# EAGLE design datalogger1.1 (EAGLE 9.6.2)
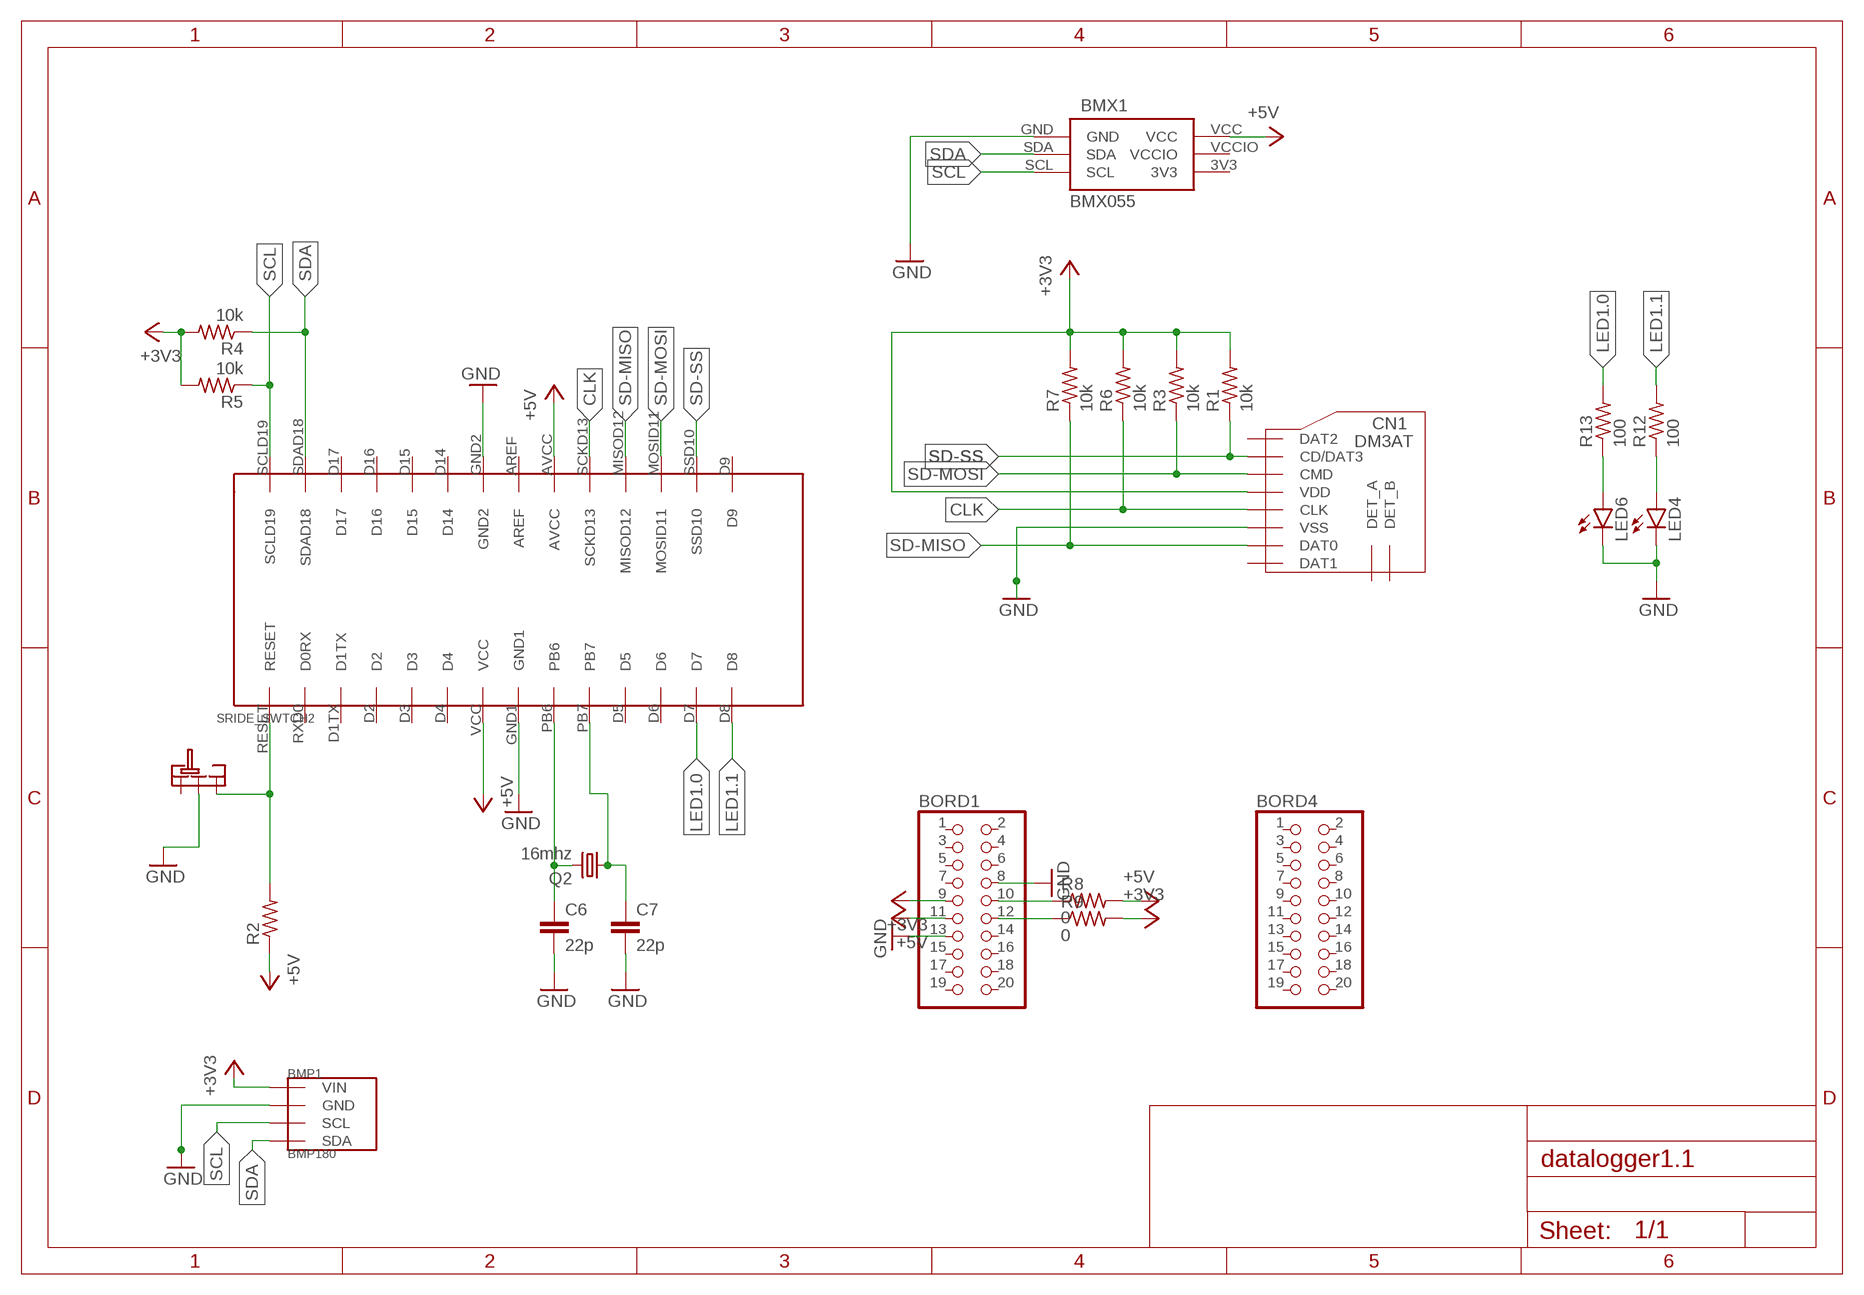
[diagram p0: schematic, sheet 1]

## Parts
BMP1  BMP180  [GY-68]
BMX1  BMX055  [BMX055]
BORD1  PINHD-2X10/90  [2X10/90]
BORD4  PINHD-2X10/90  [2X10/90]
C6  22p  C-EU025-024X044  [C025-024X044]
C7  22p  C-EU025-024X044  [C025-024X044]
CN1  DM3AT  [DM3AT]
LED4  LED5MM  [LED5MM]
LED6  LED5MM  [LED5MM]
Q2  16mhz  CRYSTALHC49S  [HC49/S]
R1  10k  R-US_0204/7  [0204/7]
R2  R-US_0204/7  [0204/7]
R3  10k  R-US_0204/7  [0204/7]
R4  10k  R-US_0204/7  [0204/7]
R5  10k  R-US_0204/7  [0204/7]
R6  10k  R-US_0204/7  [0204/7]
R7  10k  R-US_0204/7  [0204/7]
R8  0  R-US_0204/7  [0204/7]
R9  0  R-US_0204/7  [0204/7]
R12  100  R-US_0204/7  [0204/7]
R13  100  R-US_0204/7  [0204/7]
SRIDE_SWTCH2  SRIDE_SWITCH  [SRIDE_SWITCH]
U$6  ATMEGA238P  [ATMEGA328P]

## Nets
+3V3: BMP1.P1(VIN) BORD1.9 CN1.VDD R1.2 R3.2 R4.2 R5.2 R6.2 R7.2 R9.2
+5V [POWER_H]: BMX1.VCC BORD1.11 R2.1 R8.2 U$6.AVCC U$6.VCC
CLK: CN1.CLK R6.1 U$6.SCKD13
GND: BMP1.P2(GND) BMX1.GND BORD1.8 BORD1.13 C6.2 C7.2 CN1.VSS LED4.K(C) LED6.K(C) SRIDE_SWTCH2.LR U$6.GND1 U$6.GND2
LED1.0: R13.2 U$6.D7
LED1.1: R12.2 U$6.D8
N$1: LED6.A R13.1
N$2: C6.1 Q2.2 U$6.PB6
N$4: C7.1 Q2.1 U$6.PB7
N$6: BORD1.10 R8.1
N$7: LED4.A R12.1
N$8: R2.2 SRIDE_SWTCH2.R U$6.RESET
N$9: BORD1.12 R9.1
SCL: BMP1.P3(SCL) BMX1.SCL R5.1 U$6.SCLD19
SD-MISO: CN1.DAT0 R7.1 U$6.MISOD12
SD-MOSI: CN1.CMD R3.1 U$6.MOSID11
SD-SS: CN1.CD/DAT3 R1.1 U$6.SSD10
SDA: BMP1.P4(SDA) BMX1.SDA R4.1 U$6.SDAD18
Unconnected: BORD1.1 BORD1.2 BORD1.3 BORD1.4 BORD1.5 BORD1.6 BORD1.7 BORD1.14 BORD1.15 BORD1.16 BORD1.17 BORD1.18 BORD1.19 BORD1.20 BORD4.1 BORD4.2 BORD4.3 BORD4.4 BORD4.5 BORD4.6 BORD4.7 BORD4.8 BORD4.9 BORD4.10 BORD4.11 BORD4.12 BORD4.13 BORD4.14 BORD4.15 BORD4.16 BORD4.17 BORD4.18 BORD4.19 BORD4.20 CN1.DAT1 CN1.DAT2 CN1.DET_A CN1.DET_B SRIDE_SWTCH2.L U$6.AREF U$6.D1TX U$6.D2 U$6.D3 U$6.D4 U$6.D5 U$6.D6 U$6.D9 U$6.D14 U$6.D15 U$6.D16 U$6.D17 U$6.RXD0(D0RX)

## Power pins joined to a net without a drawn wire
3V3: BMX1.3V3
VCCIO: BMX1.VCCIO

## Library data of the parts
BMP1 = BMP180:BMP180
BMX1 = BMX055:BMX055
BORD1 BORD4 = pinhead:PINHD-2X10: PIN HEADER
C6 C7 = rcl:C-EU: CAPACITOR, European symbol; SPICEPREFIX: C
CN1 = microSD:DM3AT
LED4 LED6 = led:LED: LED OSRAM: - CHIPLED LG R971, LG N971, LY N971, LG Q971, LY Q971, LO R971, LY R971 LH N974, LH R974 LS Q976, LO Q976, LY Q976 LO Q996 - Hyper CHIPLED LW Q18S LB Q993, LB Q99A, LB R99A - SideLED LS A670, LO A670, LY A670, LG A670, LP A670 LB A673, LV A673, LT A673, LW A673 LH A674 LY A675 LS A676, LA A676, LO A676, LY A676, LW A676 LS A679, LY A679, LG A679 - Hyper Micro SIDELED® LS Y876, LA Y876, LO Y876, LY Y876 LT Y87S - SmartLED LW L88C, LW L88S LB L89C, LB L89S, LG L890 LS L89K, LO L89K, LY L89K LS L896, LA L896, LO L896, LY L896 - TOPLED LS T670, LO T670, LY T670, LG T670, LP T670 LSG T670, LSP T670, LSY T670, LOP T670, LYG T670 LG T671, LOG T671, LSG T671 LB T673, LV T673, LT T673, LW T673 LH T674 LS T676, LA T676, LO T676, LY T676, LB T676, LH T676, LSB T676, LW T676 LB T67C, LV T67C, LT T67C, LS T67K, LO T67K, LY T67K, LW E67C LS E67B, LA E67B, LO E67B, LY E67B, LB E67C, LV E67C, LT E67C LW T67C LS T679, LY T679, LG T679 LS T770, LO T770, LY T770, LG T770, LP T770 LB T773, LV T773, LT T773, LW T773 LH T774 LS E675, LA E675, LY E675, LS T675 LS T776, LA T776, LO T776, LY T776, LB T776 LHGB T686 LT T68C, LB T68C - Hyper Mini TOPLED® LB M676 - Mini TOPLED Santana® LG M470 LS M47K, LO M47K, LY M47K Source: http://www.osram.convergy.de LUXEON: - LUMILED® LXK2-PW12-R00, LXK2-PW12-S00, LXK2-PW14-U00, LXK2-PW14-V00 LXK2-PM12-R00, LXK2-PM12-S00, LXK2-PM14-U00 LXK2-PE12-Q00, LXK2-PE12-R00, LXK2-PE12-S00, LXK2-PE14-T00, LXK2-PE14-U00 LXK2-PB12-K00, LXK2-PB12-L00, LXK2-PB12-M00, LXK2-PB14-N00, LXK2-PB14-P00, LXK2-PB14-Q00 LXK2-PR12-L00, LXK2-PR12-M00, LXK2-PR14-Q00, LXK2-PR14-R00 LXK2-PD12-Q00, LXK2-PD12-R00, LXK2-PD12-S00 LXK2-PH12-R00, LXK2-PH12-S00 LXK2-PL12-P00, LXK2-PL12-Q00, LXK2-PL12-R00 Source: www.luxeon.com KINGBRIGHT: KA-3528ASYC Source: www.kingbright.com
Q2 = crystal:CRYSTAL: CRYSTAL; OC_FARNELL: 1667008; OC_NEWARK: unknown
R1-R9 R12 R13 = rcl:R-US_: RESISTOR, American symbol; SPICEPREFIX: R
SRIDE_SWTCH2 = Sride Switch:SRIDE_SWITCH
U$6 = atmega328p:ATMEGA238P

## Net classes
1 POWER_H: width 0.457 mm, drill 0.152 mm, clearance 0.152 mm

## Board
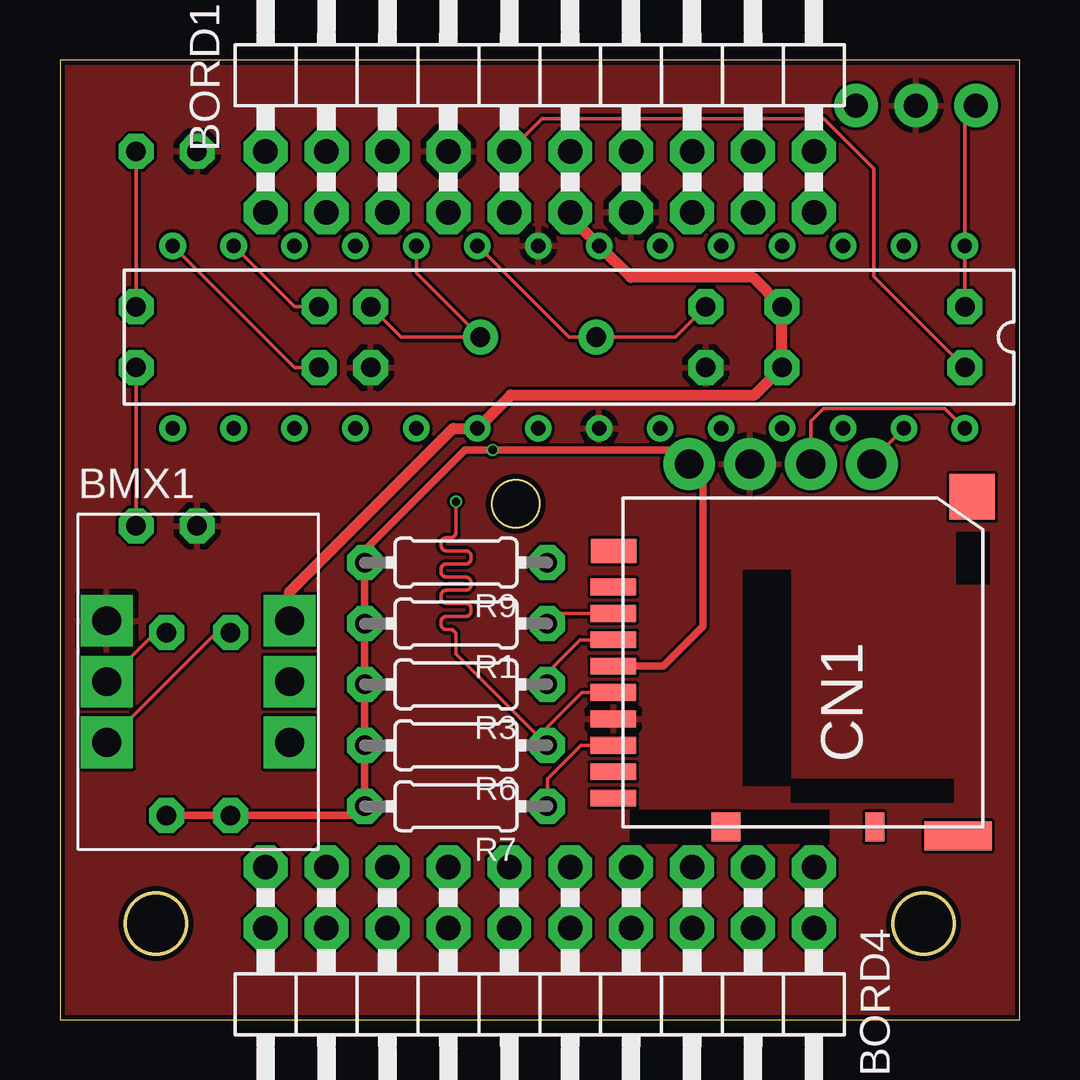
[diagram p1: board, top side]
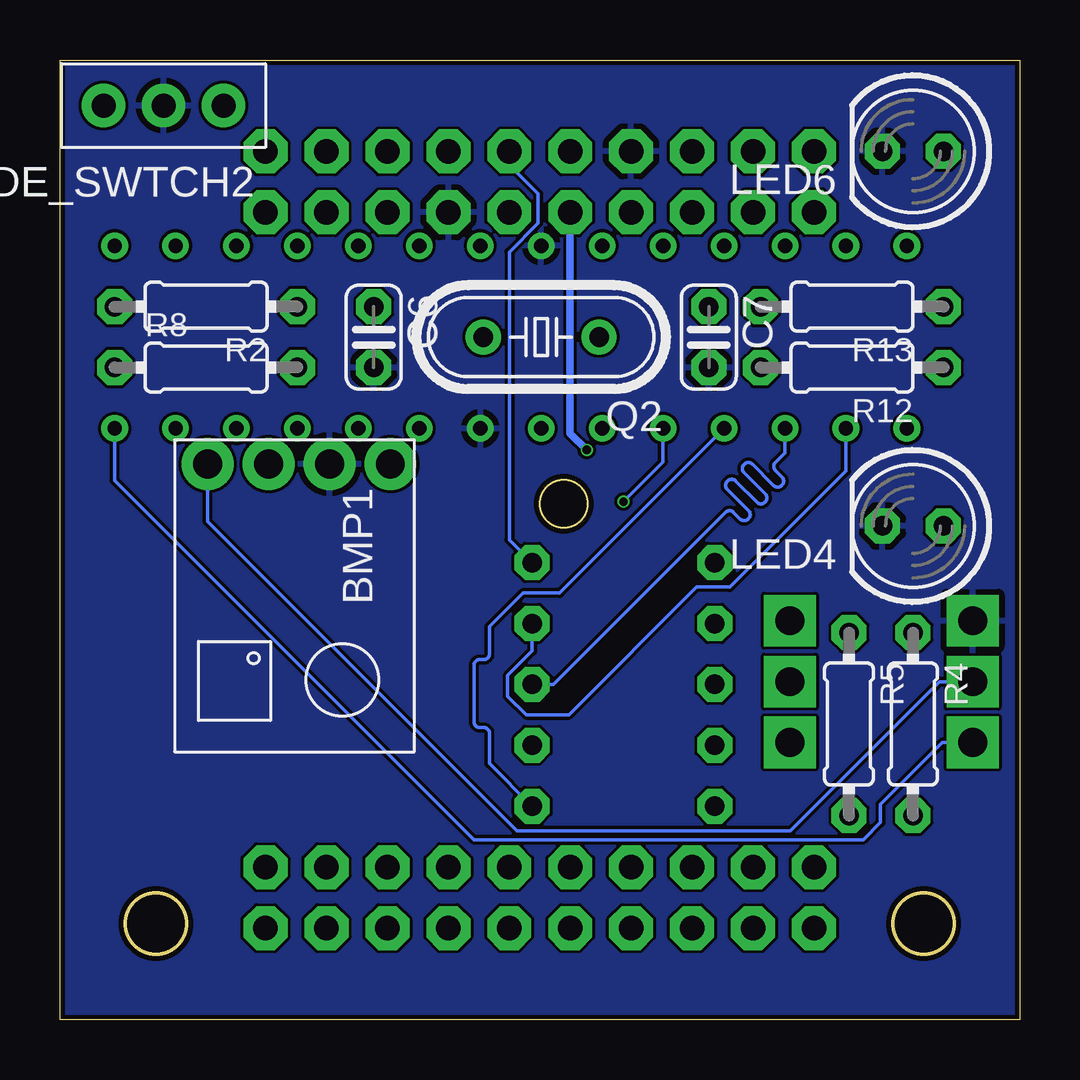
[diagram p2: board, bottom side, seen from below]

Size 40 x 40 mm. Coordinates in mm from the lower left corner, seen from the top.
Outline: 0,0 40,0 40,40 0,40 0,0
Outline: circle at 4,4 radius 1.27
Outline: circle at 36,4 radius 1.27
Outline: circle at 19,21.5 radius 1
Copper layers (1*16): Top 0.035mm / dielectric 1.6mm / Bottom 0.035mm
Design rules "jlcpcb-2layers": minimum track width 5mil, minimum drill 0.3mm, track to track 5mil, track to pad 5mil, pad to pad 5mil, via to via 5mil, smd to smd 5mil, copper to edge 0.2mm, drill to drill 6mil, minimum pad ring 10mil, minimum via ring 3mil, stop-mask expansion 4mil, vias tented up to drill 0mil, thermal gap 10mil

### Footprints (pad centres in the part's own frame; a part is rotated, then mirrored left to right if it is on the bottom)
GY-68 = drill 1.2: P1 -5,4; P2 -5,1.46; P3 -5,-1.08; P4 -5,-3.62
BMX055 = drill 1.2 pad 1.5 square: 3V3 8.81,-9.53; GND 1.19,-4.46; SCL 1.19,-9.53; SDA 1.19,-7; VCC 8.81,-4.46; VCCIO 8.81,-7
2X10/90 = drill 1.016 octagon: 1 -11.43,-6.35; 2 -11.43,-3.81; 3 -8.89,-6.35; 4 -8.89,-3.81; 5 -6.35,-6.35; 6 -6.35,-3.81; 7 -3.81,-6.35; 8 -3.81,-3.81; 9 -1.27,-6.35; 10 -1.27,-3.81; 11 1.27,-6.35; 12 1.27,-3.81; 13 3.81,-6.35; 14 3.81,-3.81; 15 6.35,-6.35; 16 6.35,-3.81; 17 8.89,-6.35; 18 8.89,-3.81; 19 11.43,-6.35; 20 11.43,-3.81
C025-024X044 = drill 0.813 octagon: 1 -1.27,0; 2 1.27,0
DM3AT = smd 0.7 x 1.9: CD/DAT3 2.2,6.4; CLK -1.1,6.4; CMD 1.1,6.4; DAT0 -3.3,6.4; DAT1 -4.4,6.4; DAT2 3.3,6.4; DET_B -5.5,6.4; VDD 0,6.4; VSS -2.2,6.4 | smd 1.2 x 0.8: DET_A -6.7,-4.5 | smd 1 x 1.9: P$9 4.8,6.381 | smd 1.2 x 1.2: P$11 -6.7,1.7 | smd 1.2 x 2.8: P$13 -7.081,-7.973 | smd 1.9 x 1.9: P$14 7.054,-8.562
LED5MM = drill 0.813 octagon: A -1.27,0; K 1.27,0
HC49/S = drill 0.813: 1 -2.413,0; 2 2.413,0
0204/7 = drill 0.813 octagon: 1 -3.81,0; 2 3.81,0
SRIDE_SWITCH = drill 1: L -2.5,0; LR 0,0; R 2.5,0
ATMEGA328P = drill 0.6: AREF 17.78,7.62; AVCC 20.32,7.62; D1TX 5.08,0; D2 7.62,0; D3 10.16,0; D4 12.7,0; D5 25.4,0; D6 27.94,0; D7 30.48,0; D8 33.02,0; D9 33.02,7.62; D14 12.7,7.62; D15 10.16,7.62; D16 7.62,7.62; D17 5.08,7.62; GND1 17.78,0; GND2 15.24,7.62; MISOD12 25.4,7.62; MOSID11 27.94,7.62; PB6 20.32,0; PB7 22.86,0; RESET 0,0; RXD0 2.54,0; SCKD13 22.86,7.62; SCLD19 0,7.62; SDAD18 2.54,7.62; SSD10 30.48,7.62; VCC 15.24,0

### Placement (x,y rotation side)
BMP1  30.23,18.16 270 bottom
BMX1  0.76,21.08 0 top
BORD1  20,40 0 top
BORD4  20,0 180 top
C6  26.92,28.45 270 bottom
C7  12.95,28.45 270 bottom
CN1  29.46,14.73 90 top
LED4  4.45,20.57 180 bottom
LED6  4.45,36.2 180 bottom
Q2  19.94,28.45 180 bottom
R1  16.51,16.51 180 top
R2  33.91,29.72 180 bottom
R3  16.51,13.97 180 top
R4  4.45,12.32 270 bottom
R5  7.11,12.32 270 bottom
R6  16.51,11.43 180 top
R7  16.51,8.89 180 top
R8  33.91,27.18 0 bottom
R9  16.51,19.05 180 top
R12  6.99,27.18 180 bottom
R13  6.99,29.72 180 bottom
SRIDE_SWTCH2  35.69,38.1 180 bottom
U$6  37.72,32.26 180 top

### Tracks (layer width: path | path; a pad name or v marks a point on that pad's centre or on a via)
+3V3  (via drill 0.35)
  Top 0.305: R4.2 R5.2 12.32,8.51 R7.2 R6.2 R3.2 R1.2 R9.2 12.7,19.56 16.89,23.75 v18.03,23.75 v18.04,23.74 v18.04,23.75 25.64,23.75 BMP1.P1 26.8,22.59 26.8,16.38 25.15,14.73 CN1.VDD
  Bottom 0.305: v18.04,23.74 18.73,24.43 BORD1.9
+5V
  Top 0.457: BORD1.11 21.27,33.47 U$6.VCC 23.8,30.94 28.88,30.94 R2.1 R8.2 28.96,26.04 18.8,26.04 U$6.AVCC 16.39,24.64 9.57,17.82 BMX1.VCC
CLK  (via drill 0.35)
  Top 0.152: CN1.CLK 21.76,13.63 20.32,12.19 R6.1 16.51,15.24 16.51,16.02 arc90 16.27,16.25 16.11,16.25 arc-90 15.88,16.49 15.88,16.57 arc-90 16.11,16.8 16.91,16.8 arc90 17.14,17.04 17.14,17.11 arc90 16.91,17.35 16.11,17.35 arc-90 15.88,17.58 15.88,17.66 arc-90 16.11,17.9 16.91,17.9 arc90 17.14,18.13 17.14,18.21 arc90 16.91,18.44 16.11,18.44 arc-90 15.88,18.68 15.88,18.76 arc-90 16.11,18.99 16.91,18.99 arc90 17.14,19.23 17.14,19.3 arc90 16.91,19.54 16.11,19.54 arc-90 15.88,19.77 15.88,19.85 arc-90 16.11,20.09 16.27,20.09 arc90 16.51,20.32 v16.51,21.59
  Bottom 0.152: v16.51,21.59 14.86,23.24 U$6.SCKD13
GND
  pour Top: 69.85,-10.16 27.94,-52.07 -24.13,-52.07 -81.28,5.08 -81.28,80.01 -68.58,92.71 53.34,92.71 69.85,76.2 69.85,-8.89
  pour Bottom: 69.85,-10.16 27.94,-52.07 -24.13,-52.07 -81.28,5.08 -81.28,80.01 -68.58,92.71 53.34,92.71 69.85,76.2
LED1.0
  Top 0.152: U$6.D7 9.78,29.72 R13.2
LED1.1
  Top 0.152: U$6.D8 9.78,27.18 R12.2
N$1
  Top 0.152: R13.1 LED6.A
N$2
  Top 0.152: U$6.PB6 21.21,28.45 Q2.2 25.65,28.45 C6.1
N$4
  Top 0.152: U$6.PB7 14.86,31.11 Q2.1 14.22,28.45 C7.1
N$6
  Top 0.152: BORD1.10 20.1,37.56 31.84,37.56 33.93,35.47 33.93,30.97 R8.1
N$7
  Top 0.152: LED4.A R12.1
N$8
  Top 0.152: SRIDE_SWTCH2.R 37.72,37.63 U$6.RESET R2.2
N$9
  Bottom 0.152: R9.1 21.27,20 21.27,32 20.07,33.2 20.07,34.42 21.27,35.62 BORD1.12
SCL
  Top 0.152: BMX1.SCL 6.53,16.13 R5.1 | BMP1.P3 31.31,24.94 31.83,25.46 36.9,25.46 U$6.SCLD19
  Bottom 0.152: BMX1.SCL 3.22,11.55 5.8,8.98 5.8,8.22 6.52,7.49 22.73,7.49 37.72,22.48 U$6.SCLD19
SD-MISO
  Top 0.152: R7.1 20.32,10.03 21.72,11.43 CN1.DAT0
  Bottom 0.152: R7.1 22.1,10.67 22.1,11.94 arc-90 22.33,12.17 22.51,12.17 arc90 22.74,12.41 22.74,14.77 arc90 22.51,15.01 22.33,15.01 arc-90 22.1,15.24 22.1,16.38 20.7,17.78 19.18,17.78 U$6.MISOD12
SD-MOSI
  Top 0.152: R3.1 20.32,14.48 21.67,15.83 CN1.CMD
  Bottom 0.152: R3.1 19.43,13.97 12.26,21.14 arc90 11.92,21.14 11.65,20.87 arc-90 11.31,20.87 11.3,20.89 arc-90 11.3,21.22 12.18,22.1 arc90 12.18,22.44 12.17,22.45 arc90 11.84,22.45 10.95,21.57 arc-90 10.62,21.57 10.6,21.58 arc-90 10.6,21.91 11.49,22.8 arc90 11.49,23.13 11.47,23.15 arc90 11.14,23.15 10.25,22.26 arc-90 9.92,22.26 9.9,22.28 arc-90 9.9,22.61 10.18,22.89 arc90 10.18,23.22 9.78,23.62 U$6.MOSID11
SD-SS
  Top 0.152: R1.1 20.74,16.93 CN1.CD/DAT3
  Bottom 0.152: U$6.SSD10 7.24,22.86 12.08,18.02 13.46,18.02 18.78,12.7 20.56,12.7 21.34,13.47 21.34,14.34 20.32,15.35 R1.1
SDA
  Top 0.152: BMX1.SDA 4,16.13 R4.1 | BMP1.P4 33.85,23.3 U$6.SDAD18
  Bottom 0.152: BMX1.SDA 3.35,14.08 9.56,7.87 20.95,7.87 33.85,20.77 BMP1.P4